# EAGLE design Front Node_MiniLock (EAGLE 8.1.0)
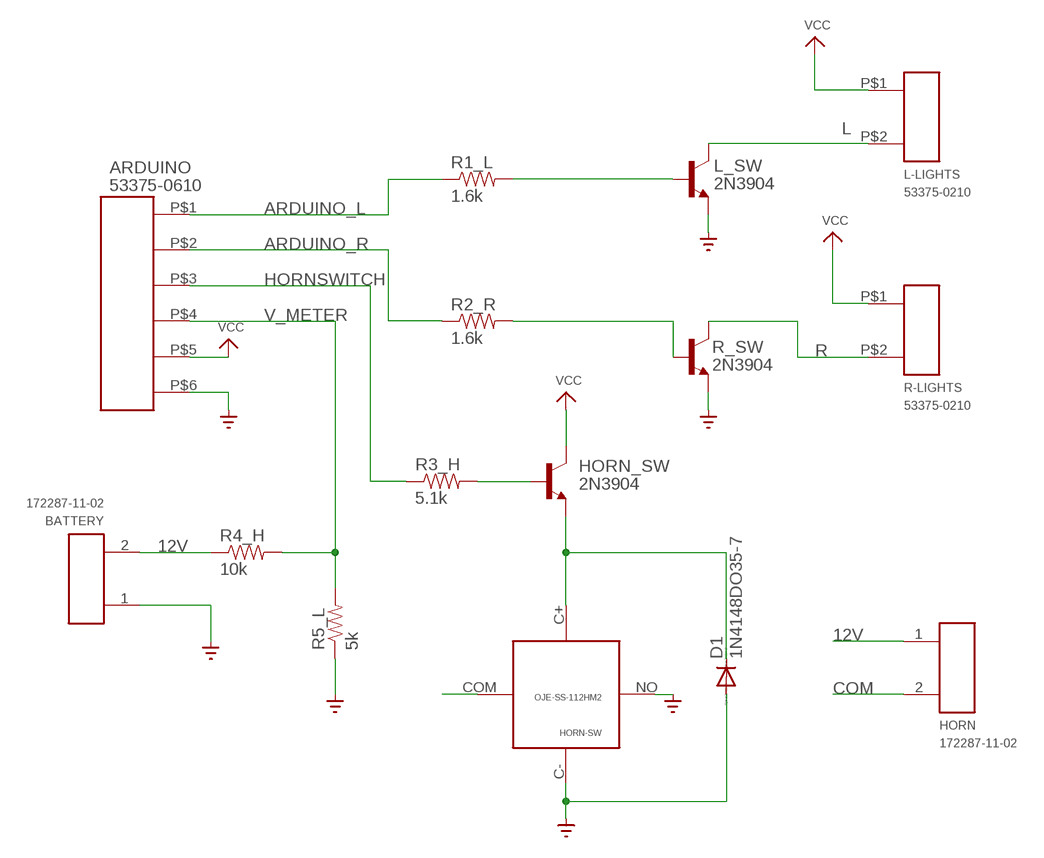
[diagram p0: schematic, sheet 1]

## Parts
ARDUINO  53375-0610  [53375-0610-MINI-LOCK]
BATTERY  172287-11-02  [172287-ULTRA-FIT]
D1  1N4148DO35-7  [DO35-7]
HORN  172287-11-02  [172287-ULTRA-FIT]
HORN-SW  OJE-SS-112HM2  [OJE-SS-112HM2-SPST-RELAY]
HORN_SW  2N3904  [TO92]
L-LIGHTS  53375-0210  [53375-0210-MINI-LOCK]
L_SW  2N3904  [TO92]
R1_L  1.6k  RESISTORPTH-1/6W  [1/6W-RES]
R2_R  1.6k  RESISTORPTH-1/6W  [1/6W-RES]
R3_H  5.1k  RESISTORPTH-1/6W  [1/6W-RES]
R4_H  10k  RESISTORPTH-1/6W  [1/6W-RES]
R5_L  5k  RESISTORPTH-1/6W  [1/6W-RES]
R-LIGHTS  53375-0210  [53375-0210-MINI-LOCK]
R_SW  2N3904  [TO92]

## Nets
12V: BATTERY.2 HORN.1 R4_H.1
ARDUINO_L: ARDUINO.P$1 R1_L.1
ARDUINO_R: ARDUINO.P$2 R2_R.1
COM: HORN-SW.COM HORN.2
GND: ARDUINO.P$6 BATTERY.1 D1.A HORN-SW.C- HORN-SW.NO L_SW.3(E) R5_L.1 R_SW.3(E) ; supply symbol labelled GND_
HORNSWITCH: ARDUINO.P$3 R3_H.1
L: L-LIGHTS.P$2 L_SW.1(C)
N$1: HORN_SW.2(B) R3_H.2
N$2: R2_R.2 R_SW.2(B)
N$3: D1.C HORN-SW.C+ HORN_SW.3(E)
N$8: L_SW.2(B) R1_L.2
R: R-LIGHTS.P$2 R_SW.1(C)
V_METER: ARDUINO.P$4 R4_H.2 R5_L.2
VCC: ARDUINO.P$5 HORN_SW.1(C) L-LIGHTS.P$1 R-LIGHTS.P$1

## Library data of the parts
ARDUINO = Hooman:53375-0610: Mini-Lock Header 6 pin 53375 series
BATTERY HORN = Hooman:172287-11-02: Ultra-Fit™ 172287 Header Molex 3.5 mm pitch 2 pin connector header
D1 = diode:1N4148: DIODE high speed (Philips)
HORN-SW = Hooman:OJE-SS-112HM2: TE SPST RELAY
HORN_SW L_SW R_SW = transistor-neu-to92:2N3904: NPN TRANSISTOR
L-LIGHTS R-LIGHTS = Hooman:53375-0210: Mini-Lock Header 2 pin 53375 series
R1_L R2_R R3_H R4_H R5_L = SparkFun-Passives:RESISTOR: Resistor Basic schematic elements and footprints for 0603, 1206, and PTH resistors.

## Board
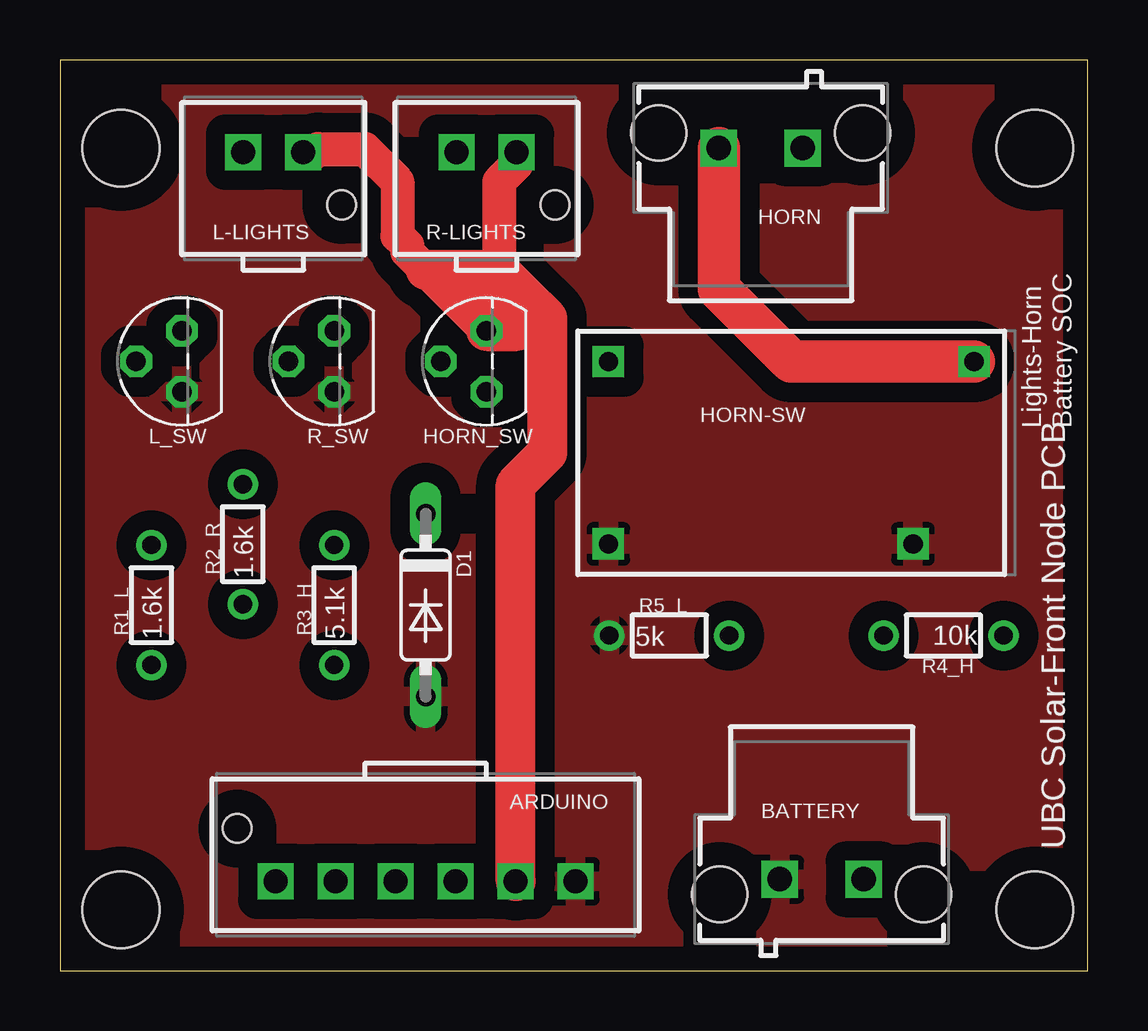
[diagram p1: board, top side]
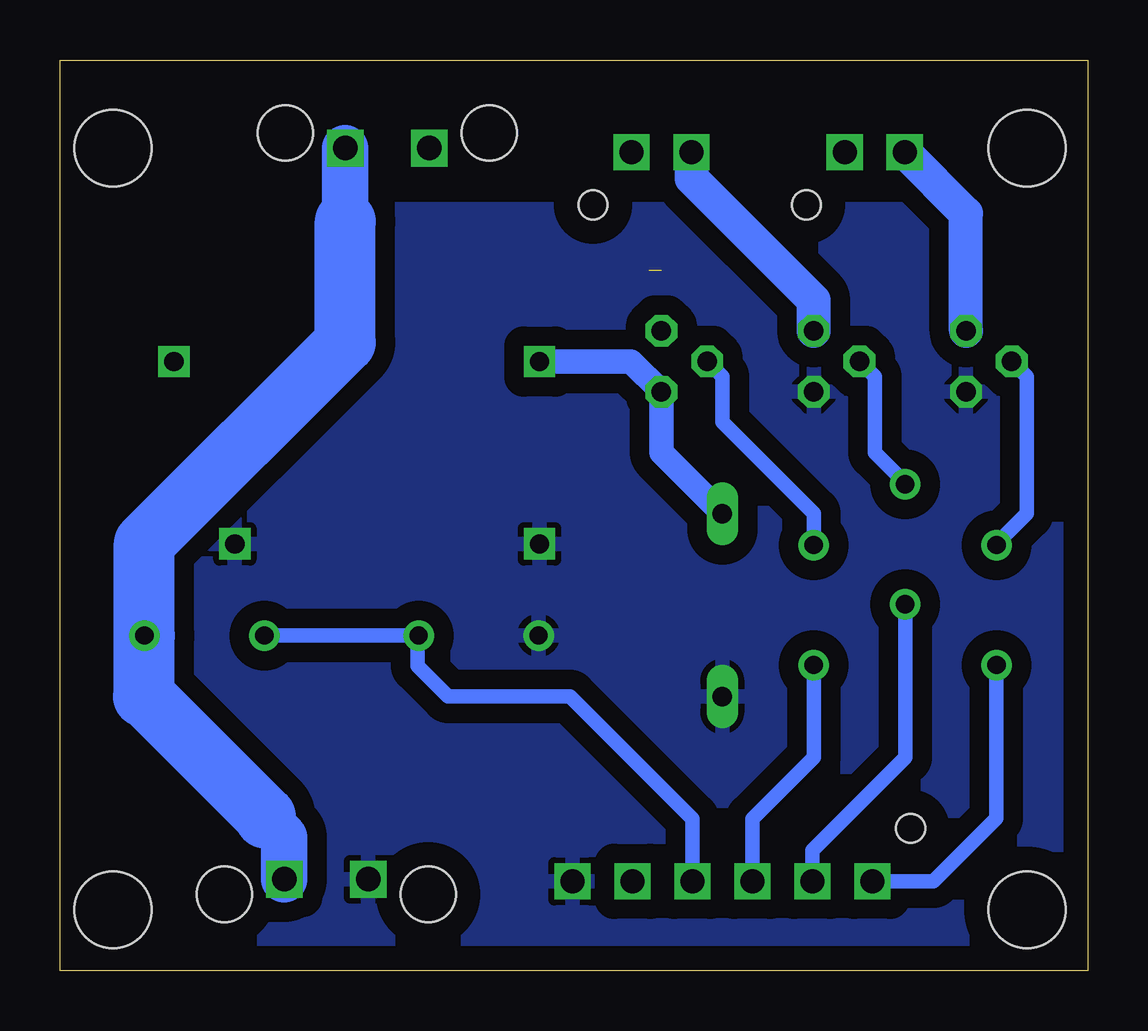
[diagram p2: board, bottom side, seen from below]

Size 42.85 x 37.96 mm. Coordinates in mm from the lower left corner, seen from the top.
Outline: 0,0 42.85,0 42.85,37.96 0,37.96 0,0
Copper layers (1*16): Top 0.035mm / dielectric 1.5mm / Bottom 0.035mm
Design rules "default": minimum track width 10mil, minimum drill 24mil, track to track 8mil, track to pad 8mil, pad to pad 8mil, via to via 8mil, smd to smd 8mil, copper to edge 40mil, drill to drill 8mil, minimum pad ring 10mil, minimum via ring 8mil, stop-mask expansion 4mil, vias tented up to drill 0mil, thermal gap 10mil
Holes 3.2 mm at 2.54,34.29 2.54,2.54 40.64,2.54 40.64,34.29
tKeepout: area -1.3,38.1 to 44.5,39.4; area 42.9,-1.3 to 44.5,38.1; area -1.3,-1.3 to 44.5,0; area -1.3,0 to 0,39.4

### Footprints (pad centres in the part's own frame; a part is rotated, then mirrored left to right if it is on the bottom)
53375-0610-MINI-LOCK = drill 1 square: P$1 6.25,1.1; P$2 3.75,1.1; P$3 1.25,1.1; P$4 -1.25,1.1; P$5 -3.75,1.1; P$6 -6.25,1.1 | hole 1.2: 7.85,-1.1
172287-ULTRA-FIT = drill 1.02 square: 1 -1.75,0; 2 1.75,0 | hole 2.3: -4.25,-0.63; 4.25,-0.63
DO35-7 = drill 0.813 long: A 3.81,0; C -3.81,0
OJE-SS-112HM2-SPST-RELAY = drill 0.8 square: C+ -6.35,3.8; C- -6.35,-3.8; COM 8.89,3.8; NO 6.35,-3.8
TO92 = drill 0.813 octagon: 1 1.27,0; 2 0,1.905; 3 -1.27,0
53375-0210-MINI-LOCK = drill 1 square: P$1 1.25,1.1; P$2 -1.25,1.1 | hole 1.2: 2.85,-1.1
1/6W-RES = drill 0.762: 1 -2.5,0; 2 2.5,0

### Placement (x,y rotation side)
ARDUINO  15.24,4.83 180 top
BATTERY  31.75,3.81 0 top
D1  15.24,15.24 270 top
HORN  29.21,34.29 180 top
HORN-SW  29.21,21.59 0 top
HORN_SW  17.78,25.4 90 top
L-LIGHTS  8.89,33.02 0 top
L_SW  5.08,25.4 90 top
R1_L  3.81,15.24 90 top
R2_R  7.62,17.78 90 top
R3_H  11.43,15.24 90 top
R4_H  36.83,13.97 180 top
R5_L  25.4,13.97 0 top
R-LIGHTS  17.78,33.02 0 top
R_SW  11.43,25.4 90 top

### Tracks (layer width: path | path; a pad name or v marks a point on that pad's centre or on a via)
12V
  Bottom 1.93: 39.37,14.01 R4_H.1 | BATTERY.2 33.5,5.56 34.29,6.35 | HORN.1 30.96,31.24 30.99,31.24
  Bottom 2.54: 39.33,11.47 R4_H.1 39.33,17.82 30.96,26.19 30.96,31.24 | 39.33,11.47 39.37,11.43 | 34.29,6.35 34.29,6.43 39.33,11.47
ARDUINO_L
  Bottom 0.61: ARDUINO.P$1 6.43,3.73 3.81,6.35 R1_L.1
ARDUINO_R
  Bottom 0.61: ARDUINO.P$2 11.49,5.02 7.62,8.89 R2_R.1
COM
  Top 1.778: HORN.2 27.46,28.42 30.48,25.4 HORN-SW.COM
GND
  pour Top (isolate 0.813): 0,38.1 43.18,38.1 43.18,0 1.27,0
  pour Bottom (isolate 0.813): 0,31.75 39.37,31.75 39.37,0 0,0
HORNSWITCH
  Bottom 0.61: ARDUINO.P$3 13.99,6.33 11.43,8.89 R3_H.1
L
  Bottom 1.422: L_SW.1 5.08,31.56 L-LIGHTS.P$2
N$1
  Bottom 0.61: R3_H.2 11.43,19.05 15.24,22.86 15.24,24.77 HORN_SW.2
N$2
  Bottom 0.61: R2_R.2 7.62,20.32 8.89,21.59 8.89,24.77 R_SW.2
N$3
  Bottom 1.016: D1.C 17.78,21.59 HORN_SW.3 19.04,25.39 HORN-SW.C+
N$8
  Bottom 0.61: R1_L.2 3.81,17.78 2.54,19.05 2.54,24.77 L_SW.2
R
  Bottom 1.422: R_SW.1 11.43,27.94 16.51,33.02 16.51,34.1 R-LIGHTS.P$2
V_METER
  Bottom 0.61: ARDUINO.P$4 16.49,6.33 21.59,11.43 26.67,11.43 27.94,12.7 27.94,13.93 R5_L.2 R4_H.2
VCC  (1 unrouted)
  Top 1.422: L-LIGHTS.P$1 10.65,34.12 10.78,34.25 12.7,34.25 14.07,32.88 14.07,30.64 14.48,30.23 14.48,29.97 15.24,29.21 HORN_SW.1 18.3,27.19 18.3,29.21 18.3,32.88 19.03,33.61 R-LIGHTS.P$1
  Top 1.676: ARDUINO.P$5 18.99,20.26 20.32,21.59 20.32,27.19 19.31,28.2 | 19.31,28.2 18.3,29.21 15.24,29.21 | HORN_SW.1 19.05,26.67 19.05,27.94 19.31,28.2 | 17.78,29.21 17.78,27.94

### Text on the board
tPlace: Lights-Horn | Battery SOC | UBC Solar-Front Node PCB